# Altium schematic sheet n20电动螺丝刀_TEST（测试用！！！）.schdoc
size 167 x 139 mm
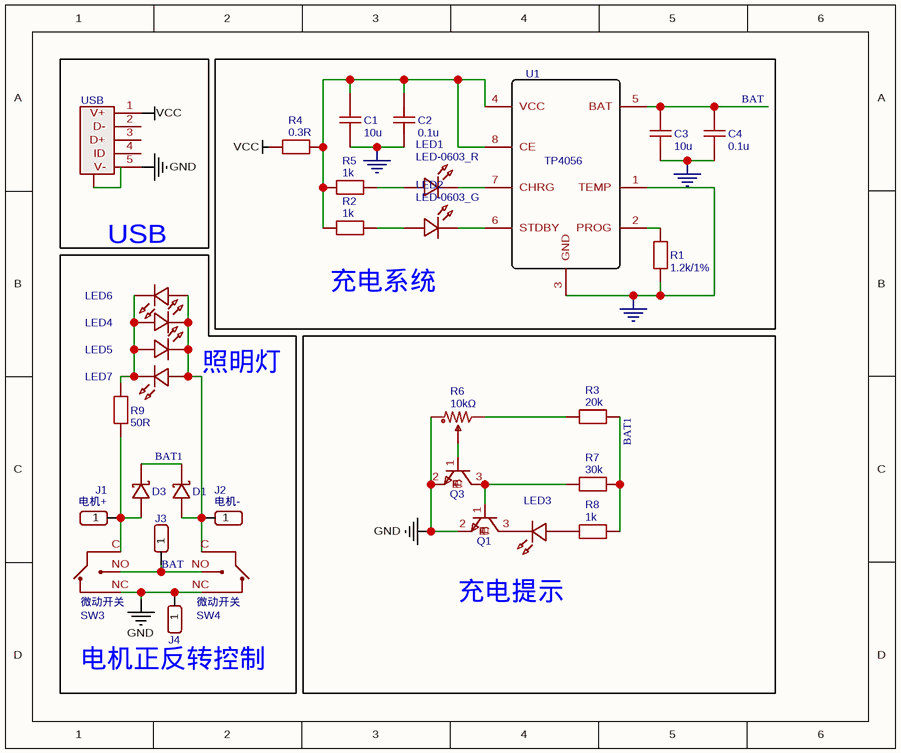
[diagram p0: n20电动螺丝刀_TEST（测试用！！！）.schdoc]

## Parts
C1  10u  [C0603]
C2  0.1u  [C0603]
C3  10u  [C0603]
C4  0.1u  [C0603]
D1  1N5817WS  [SOD-323_L1.8-W1.3-LS2.5-RD]  (value not drawn)
D3  1N5817WS  [SOD-323_L1.8-W1.3-LS2.5-RD]  (value not drawn)
J1  电机+  [HDR-M-2.54_1X1]
J2  电机-  [HDR-M-2.54_1X1]
J3  HDR-M-2.54_1x1  [HDR-M-2.54_1X1]  (value not drawn)
J4  HDR-M-2.54_1x1  [HDR-M-2.54_1X1]  (value not drawn)
LED1  LED-0603_R  [LED0603_RED]
LED2  LED-0603_G  [LED0603_GREEN]
LED3  LED-0603_R  [LED0603_RED]  (value not drawn)
LED4  LED-0603_R  [LED0603_RED]  (value not drawn)
LED5  LED-0603_R  [LED0603_RED]  (value not drawn)
LED6  LED-0603_R  [LED0603_RED]  (value not drawn)
LED7  LED-0603_R  [LED0603_RED]  (value not drawn)
Q1  S8050_C2926165  [SOT-23-3_L2.9-W1.3-P1.90-LS2.4-BR]  (value not drawn)
Q3  S8050_C2926165  [SOT-23-3_L2.9-W1.3-P1.90-LS2.4-BR]  (value not drawn)
R1  1.2k/1%  [R0603]
R2  1k  [R0603]
R3  20k  [R0603]
R4  0.3R  [R0603]
R5  1k  [R0603]
R6  10kΩ  [RES-ADJ-SMD_3P-L3.0-W3.8-P1.75-BR]
R7  30k  [R0603]
R8  1k  [R0603]
R9  50R  [R0603]
SW3  微动开关  [SW-TH_DEALON_LF-108]
SW4  微动开关  [SW-TH_DEALON_LF-108]
U1  TP4056  [SOP8_150MIL_JX]
USB  micro 5PFour-legged board7.2There is a column card point0.4m  [MICRO-USB-SMD_5P-P0.65-H-F-C40943]  (value not drawn)

## Blocks framed on the sheet
USB: USB
充电系统: C1-C4 LED1 LED2 R1 R2 R4 R5 U1
充电提示: LED3 Q1 Q3 R3 R6-R8

## Nets
GND: C1.1 C2.1 C3.1 C4.1 J4.1 Q1.2(E) Q3.2(E) R1.1 R6.1 SW3.NC SW4.NC U1.1(TEMP) U1.3(GND) USB.5(V-)
VCC: R4.1 USB.1(V+)
BAT: C3.2 C4.2 J3.1 SW3.NO SW4.NO U1.5(BAT)
BAT1: D1.1 D3.1 R3.2 R7.2 R8.2
NetC1_2: C1.2 C2.2 R2.1 R4.2 R5.1 U1.4(VCC) U1.8(CE)
NetD1_2: D1.2 J2.1 LED4.2 LED5.2 LED6.1 LED7.1 SW4.C
NetD3_2: D3.2 J1.1 R9.1 SW3.C
NetLED1_1: LED1.1 R5.2
NetLED1_2: LED1.2 U1.7(CHRG)
NetLED2_1: LED2.1 R2.2
NetLED2_2: LED2.2 U1.6(STDBY)
NetLED3_1: LED3.1 R8.1
NetLED3_2: LED3.2 Q1.3(C)
NetLED4_1: LED4.1 LED5.1 LED6.2 LED7.2 R9.2
NetQ1_1: Q1.1(B) Q3.3(C) R7.1
NetQ3_1: Q3.1(B) R6.2
NetR1_2: R1.2 U1.2(PROG)
NetR3_1: R3.1 R6.3

Not connected (* = marked no-connect by the designer): USB 0(MTN6) 2(D-) 3(D+) 4(ID)

## Notes on the sheet
- 照明灯
- 电机正反转控制

## Library data of the parts
C1 C3 = 10u: nameAlias: Value(F); Contributor: LCEDA_Lib; spicePre: C; spiceSymbolName: C_0603_US
C2 C4 = 0.1u: nameAlias: Value(F); Contributor: LCEDA_Lib; spicePre: C; spiceSymbolName: C_0603_US
D1 D3 = 1N5817WS: BOM_Manufacturer: KEXIN; Contributor: LCSC; BOM_Supplier: LCSC; BOM_Supplier Part: C489146; BOM_Manufacturer Part: 1N5817WS; BOM_JLCPCB Part Class: Extended Part; spicePre: D; spiceSymbolName: 1N5817WS
J1 = 电机+: Contributor: LCEDA_Lib; BOM_Supplier Part: C81276; BOM_Supplier: LCSC; spicePre: J; spiceSymbolName: HDR-M-2.54_1x1
J2 = 电机-: Contributor: LCEDA_Lib; BOM_Supplier Part: C81276; BOM_Supplier: LCSC; spicePre: J; spiceSymbolName: HDR-M-2.54_1x1
J3 J4 = HDR-M-2.54_1x1: Contributor: LCEDA_Lib; BOM_Supplier Part: C81276; BOM_Supplier: LCSC; spicePre: J; spiceSymbolName: HDR-M-2.54_1x1
LED1 LED3-LED7 = LED-0603_R: BOM_Manufacturer: EVERLIGHT(台湾亿光); BOM_Manufacturer Part: 19-217/R6C-AL1M2VY/3T; Contributor: LCEDA_01; BOM_Supplier Part: C72044; BOM_Supplier: LCSC; spicePre: L; spiceSymbolName: LED-0603_R
LED2 = LED-0603_G: BOM_Manufacturer: EVERLIGHT(台湾亿光); BOM_Manufacturer Part: 19-217/GHC-YR1S2/3T; Contributor: LCEDA_Lib; BOM_Supplier Part: C72043; BOM_Supplier: LCSC; spicePre: L; spiceSymbolName: LED-0603_G
Q1 Q3 = S8050_C2926165: BOM_Manufacturer: FOSAN(富信); BOM_Manufacturer Part: S8050; Contributor: LCSC; BOM_Supplier: LCSC; BOM_Supplier Part: C2926165; BOM_JLCPCB Part Class: Extended Part; spicePre: Q; spiceSymbolName: S8050_C2926165
R1 = 1.2k/1%: nameAlias: Value(Ω); Contributor: LCEDA_Lib; spicePre: R; spiceSymbolName: R_0603_EU
R2 R5 R8 = 1k: nameAlias: Value(Ω); Contributor: LCEDA_Lib; spicePre: R; spiceSymbolName: R_0603_EU
R3 = 20k: nameAlias: Value(Ω); Contributor: LCEDA_Lib; spicePre: R; spiceSymbolName: R_0603_EU
R4 = 0.3R: nameAlias: Value(Ω); Contributor: LCEDA_Lib; spicePre: R; spiceSymbolName: R_0603_EU
R6 = 10kΩ: BOM_Manufacturer: BOURNS; BOM_Manufacturer Part: TC33X-2-103E; Contributor: LCSC; nameAlias: Resistance; BOM_Supplier: LCSC; BOM_Supplier Part: C719176; BOM_JLCPCB Part Class: Extended Part; spicePre: R; spiceSymbolName: TC33X-2-103E
R7 = 30k: nameAlias: Value(Ω); Contributor: LCEDA_Lib; spicePre: R; spiceSymbolName: R_0603_EU
R9 = 50R: nameAlias: Value(Ω); Contributor: LCEDA_Lib; spicePre: R; spiceSymbolName: R_0603_EU
SW3 SW4 = 微动开关: BOM_Manufacturer: DEALON(德艺隆); BOM_Manufacturer Part: LF-108; Contributor: LCSC; BOM_Supplier: LCSC; BOM_Supplier Part: C2914466; spicePre: S; spiceSymbolName: LF-108
USB = micro 5PFour-legged board7.2There is a column card point0.4m: BOM_Manufacturer: ValuePro; BOM_Supplier: LCSC; BOM_Manufacturer Part: micro 5PFour-legged board7.2There is a column card point0.4m; image: //image.lceda.cn/szlcsc/C40943.jpg; BOM_Supplier Part: C40943; spicePre: U; spiceSymbolName: micro 5PFour-legged board7.2There is a column card point0.4m
U1 = TP4056: BOM_Supplier: LCSC; spicePre: U